# Altium project JacdacCableExtender 38.PrjPCB
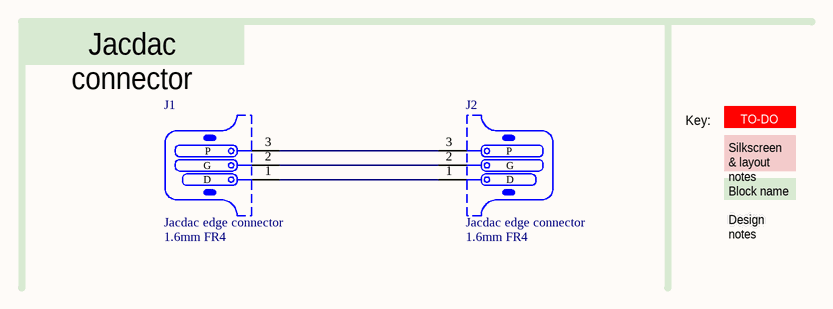
[diagram p0: JacdacCableExtender 38.SchDoc]
ProjectRevision: 1.1; ProjectLicenceTerms: Attribution 4.0 International (CC BY 4.0); ProjectDrawnBy: S. Hodges; ProjectCodenameID: 38; ProjectCodenameDescription: Double-ended Jacdac cable extender; ProjectCodeName: JacdacCableExtender
1 sheet, 2 parts. Net scope: global (net labels, ports and power ports of the same name join across sheets).
Board file: JacdacCableExtender 38.PcbDoc

## Sheet JacdacCableExtender 38.SchDoc: Complete design
size A4; DrawnBy: S. Hodges; DocumentNumber: 1; Revision: 1.1; SheetNumber: 1; SheetTotal: 1; VersionControl_RevNumber: 1

### Parts
J1  Jacdac edge connector  PCB Type: 1.6mm FR4  [JACDAC_EDGE_CONNECTOR_0.2mm_T&G]  (no BOM)
J2  Jacdac edge connector  PCB Type: 1.6mm FR4  [JACDAC_EDGE_CONNECTOR_0.2mm_T&G]  (no BOM)

### Nets
NetJ1_1: J1.1(D) J2.1(D)
NetJ1_2: J1.2(G) J2.2(G)
NetJ1_3: J1.3(P) J2.3(P)

### Notes on the sheet
- Jacdac connector
- Key:
- TO-DO
- Block name
- Silkscreen & layout notes
- Design notes
- PROJECT FILENAME
- PROJECT CODENAME
- Microsoft
- PROJECT DESCRIPTION
- SHEET DESCRIPTION
- SHEET FILENAME
- LICENCE
- LAST MODIFIED
- PAGE
- OF
- DRAWN BY
- REVISION
- PCB ID

### Library data of the parts
J1 J2 = Jacdac edge connector: 3 pin Jacdac edge connector 1.27mm pitch; Manufacturer Part Number: JACDAC_EDGE_CONNECTOR; Checked By: ?; Created By: D. Gakure; ComponentLink1Description: Yuliang JACDAC cable connector drawing online; ComponentLink1URL: https://github.com/microsoft/jacdac-mdk/blob/main/connector/JACDAC-Connector-by-Yuliang-2020-11-28.pdf; ComponentLink2Description: JACDAC PCB edge connector spec onlin; ComponentLink2URL: https://github.com/microsoft/jacdac-mdk/blob/main/connector/JACDAC_PCB_Edge_Connector_Drawing_JD-PEC-01_rev_01.pdf